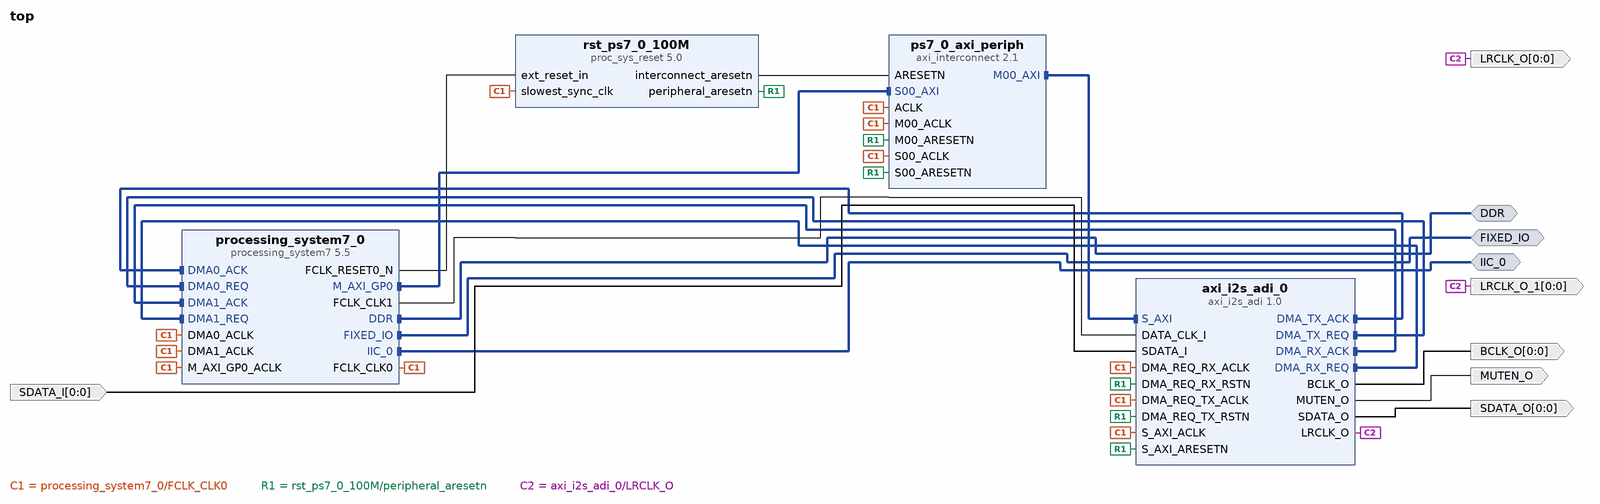
[diagram p0: block diagram of the top level]
# Vivado block design top, xc7z010clg400-1, Vivado 2016.3
create_bd_design top

create_bd_intf_port -mode Master -vlnv xilinx.com:interface:ddrx_rtl:1.0 DDR
create_bd_intf_port -mode Master -vlnv xilinx.com:display_processing_system7:fixedio_rtl:1.0 FIXED_IO
create_bd_intf_port -mode Master -vlnv xilinx.com:interface:iic_rtl:1.0 IIC_0
create_bd_port -dir I -from 0 -to 0 SDATA_I
create_bd_port -dir O -from 0 -to 0 BCLK_O
create_bd_port -dir O -from 0 -to 0 LRCLK_O
create_bd_port -dir O -from 0 -to 0 SDATA_O
create_bd_port -dir O MUTEN_O
create_bd_port -dir O -from 0 -to 0 LRCLK_O_1

create_bd_cell -type ip -vlnv xilinx.com:ip:processing_system7:5.5 processing_system7_0
set_property -dict [list \
  CONFIG.PCW_UIPARAM_DDR_FREQ_MHZ 525 \
  CONFIG.PCW_CRYSTAL_PERIPHERAL_FREQMHZ 50.000000 \
  CONFIG.PCW_APU_PERIPHERAL_FREQMHZ 650 \
  CONFIG.PCW_SDIO_PERIPHERAL_FREQMHZ 50 \
  CONFIG.PCW_FPGA0_PERIPHERAL_FREQMHZ 100 \
  CONFIG.PCW_FPGA1_PERIPHERAL_FREQMHZ 12.288 \
  CONFIG.PCW_USE_DMA0 1 \
  CONFIG.PCW_USE_DMA1 1 \
  CONFIG.PCW_EN_CLK1_PORT 1 \
  CONFIG.PCW_EN_RST1_PORT 1 \
  CONFIG.PCW_IMPORT_BOARD_PRESET /home/jaxc/FPGA/DJ-Jaxc/ZYBO_zynq_def.xml \
  CONFIG.PCW_PRESET_BANK1_VOLTAGE {LVCMOS 1.8V} \
  CONFIG.PCW_UIPARAM_DDR_PARTNO {MT41K128M16 JT-125} \
  CONFIG.PCW_QSPI_PERIPHERAL_ENABLE 1 \
  CONFIG.PCW_QSPI_GRP_SINGLE_SS_ENABLE 1 \
  CONFIG.PCW_QSPI_GRP_FBCLK_ENABLE 1 \
  CONFIG.PCW_ENET0_PERIPHERAL_ENABLE 1 \
  CONFIG.PCW_ENET0_ENET0_IO {MIO 16 .. 27} \
  CONFIG.PCW_ENET0_GRP_MDIO_ENABLE 1 \
  CONFIG.PCW_SD0_PERIPHERAL_ENABLE 1 \
  CONFIG.PCW_SD0_GRP_CD_ENABLE 1 \
  CONFIG.PCW_SD0_GRP_CD_IO {MIO 47} \
  CONFIG.PCW_SD0_GRP_WP_ENABLE 0 \
  CONFIG.PCW_UART1_PERIPHERAL_ENABLE 1 \
  CONFIG.PCW_USB0_PERIPHERAL_ENABLE 1 \
  CONFIG.PCW_GPIO_MIO_GPIO_ENABLE 0 \
  CONFIG.PCW_FCLK1_PERIPHERAL_CLKSRC {ARM PLL} \
] [get_bd_cells processing_system7_0]
# 99 more settings of processing_system7_0 are not shown: defaults, MIO pin electricals, DDR timing, and values the tool derives
create_bd_cell -type ip -vlnv analogdeviceinc.com:adi:axi_i2s_adi:1.0 axi_i2s_adi_0
set_property -dict {CONFIG.C_DMA_TYPE 1} [get_bd_cells axi_i2s_adi_0]
create_bd_cell -type ip -vlnv xilinx.com:ip:axi_interconnect:2.1 ps7_0_axi_periph
set_property -dict {CONFIG.NUM_MI 1} [get_bd_cells ps7_0_axi_periph]
create_bd_cell -type ip -vlnv xilinx.com:ip:proc_sys_reset:5.0 rst_ps7_0_100M

# ---- connections ----

connect_bd_intf_net [get_bd_intf_pins processing_system7_0/M_AXI_GP0] [get_bd_intf_pins ps7_0_axi_periph/S00_AXI]
connect_bd_intf_net [get_bd_intf_pins ps7_0_axi_periph/M00_AXI] [get_bd_intf_pins axi_i2s_adi_0/S_AXI]
connect_bd_intf_net [get_bd_intf_pins axi_i2s_adi_0/DMA_TX_ACK] [get_bd_intf_pins processing_system7_0/DMA0_ACK]
connect_bd_intf_net [get_bd_intf_pins axi_i2s_adi_0/DMA_TX_REQ] [get_bd_intf_pins processing_system7_0/DMA0_REQ]
connect_bd_intf_net [get_bd_intf_pins axi_i2s_adi_0/DMA_RX_ACK] [get_bd_intf_pins processing_system7_0/DMA1_ACK]
connect_bd_intf_net [get_bd_intf_pins axi_i2s_adi_0/DMA_RX_REQ] [get_bd_intf_pins processing_system7_0/DMA1_REQ]
connect_bd_intf_net [get_bd_intf_ports DDR] [get_bd_intf_pins processing_system7_0/DDR]
connect_bd_intf_net [get_bd_intf_ports FIXED_IO] [get_bd_intf_pins processing_system7_0/FIXED_IO]
connect_bd_intf_net [get_bd_intf_ports IIC_0] [get_bd_intf_pins processing_system7_0/IIC_0]
connect_bd_net [get_bd_pins processing_system7_0/FCLK_CLK0] \
  [get_bd_pins processing_system7_0/M_AXI_GP0_ACLK] [get_bd_pins rst_ps7_0_100M/slowest_sync_clk] \
  [get_bd_pins axi_i2s_adi_0/S_AXI_ACLK] [get_bd_pins axi_i2s_adi_0/DMA_REQ_RX_ACLK] \
  [get_bd_pins axi_i2s_adi_0/DMA_REQ_TX_ACLK] [get_bd_pins processing_system7_0/DMA0_ACLK] \
  [get_bd_pins processing_system7_0/DMA1_ACLK] [get_bd_pins ps7_0_axi_periph/S00_ACLK] [get_bd_pins ps7_0_axi_periph/ACLK] \
  [get_bd_pins ps7_0_axi_periph/M00_ACLK]
connect_bd_net [get_bd_pins processing_system7_0/FCLK_RESET0_N] [get_bd_pins rst_ps7_0_100M/ext_reset_in]
connect_bd_net [get_bd_pins rst_ps7_0_100M/peripheral_aresetn] \
  [get_bd_pins axi_i2s_adi_0/S_AXI_ARESETN] [get_bd_pins axi_i2s_adi_0/DMA_REQ_TX_RSTN] \
  [get_bd_pins axi_i2s_adi_0/DMA_REQ_RX_RSTN] [get_bd_pins ps7_0_axi_periph/S00_ARESETN] \
  [get_bd_pins ps7_0_axi_periph/M00_ARESETN]
connect_bd_net [get_bd_pins rst_ps7_0_100M/interconnect_aresetn] [get_bd_pins ps7_0_axi_periph/ARESETN]
connect_bd_net [get_bd_ports SDATA_I] [get_bd_pins axi_i2s_adi_0/SDATA_I]
connect_bd_net [get_bd_pins axi_i2s_adi_0/BCLK_O] [get_bd_ports BCLK_O]
connect_bd_net [get_bd_pins axi_i2s_adi_0/LRCLK_O] [get_bd_ports LRCLK_O] [get_bd_ports LRCLK_O_1]
connect_bd_net [get_bd_pins axi_i2s_adi_0/SDATA_O] [get_bd_ports SDATA_O]
connect_bd_net [get_bd_pins axi_i2s_adi_0/MUTEN_O] [get_bd_ports MUTEN_O]
connect_bd_net [get_bd_pins processing_system7_0/FCLK_CLK1] [get_bd_pins axi_i2s_adi_0/DATA_CLK_I]

# ---- address map ----
assign_bd_address -offset 0x43C00000 -range 64K -target_address_space [get_bd_addr_spaces processing_system7_0/Data] [get_bd_addr_segs axi_i2s_adi_0/S_AXI/S_AXI_reg]

validate_bd_design
save_bd_design
